# EAGLE schematic MotorEncoder (EAGLE 9.0.0)
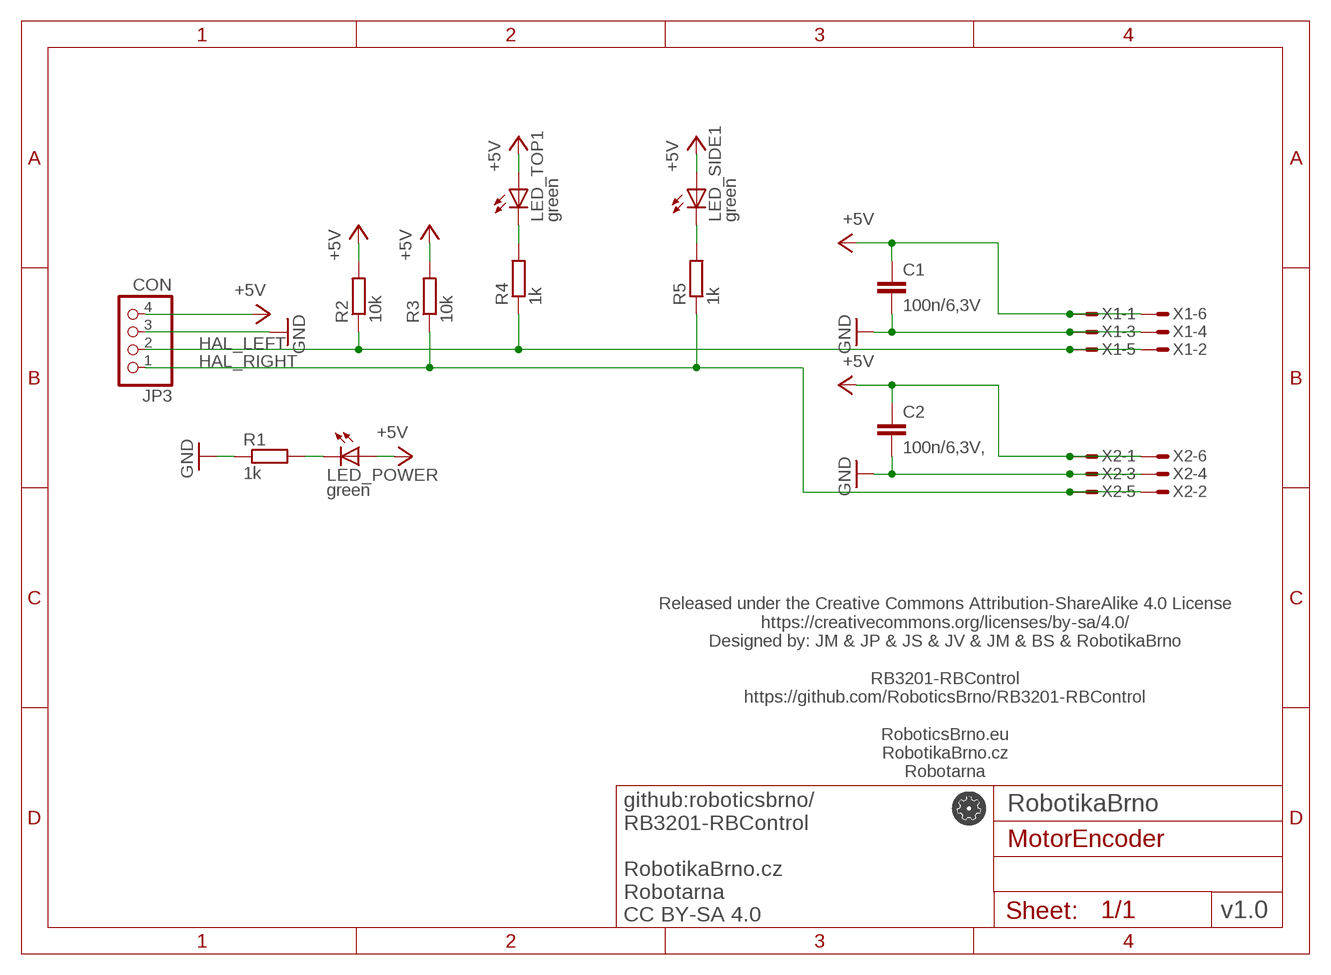
[diagram p0: schematic, sheet 1]

## Parts
C1  100n/6,3V  C-EUC0603  [C0603]
C2  100n/6,3V,  C-EUC0603  [C0603]
JP3  CON  PINHD-1X4/90  [1X04/90]
LED_POWER  green  LEDCHIPLED_0603  [CHIPLED_0603]
LED_SIDE1  green  LEDCHIPLED_0603  [CHIPLED_0603]
LED_TOP1  green  LEDCHIPLED_0603  [CHIPLED_0603]
R1  1k  R-EU_R0603  [R0603]
R2  10k  R-EU_R0603  [R0603]
R3  10k  R-EU_R0603  [R0603]
R4  1k  R-EU_R0603  [R0603]
R5  1k  R-EU_R0603  [R0603]
X1  PHB_1MM27_2X03_SNT_S  [PHB_1MM27_2X03_SNT]
X2  PHB_1MM27_2X03_SNT_S  [PHB_1MM27_2X03_SNT]

## Nets
+5V: C1.1 C2.1 JP3.4 LED_POWER.A LED_SIDE1.A LED_TOP1.A R2.2 R3.2 X1.1 X1.6 X2.1 X2.6
GND: C1.2 C2.2 JP3.3 R1.1 X1.3 X1.4 X2.3 X2.4
HAL_LEFT: JP3.2 R2.1 R4.1 X1.2 X1.5
HAL_RIGHT: JP3.1 R3.1 R5.1 X2.2 X2.5
LED_POWER: LED_POWER.C R1.2
LED_SIDE1: LED_SIDE1.C R5.2
LED_TOP1: LED_TOP1.C R4.2

## Notes on the sheet
- Released under the Creative Commons Attribution-ShareAlike 4.0 License
  https://creativecommons.org/licenses/by-sa/4.0/
  Designed by: JM & JP & JS & JV & JM & BS & RobotikaBrno
  
  RB3201-RBControl
  https://github.com/RoboticsBrno/RB3201-RBControl
  
  RoboticsBrno.eu
  RobotikaBrno.cz
  Robotarna
- RobotikaBrno
- v1.0
- github:roboticsbrno/
  RB3201-RBControl
  
  RobotikaBrno.cz
  Robotarna
  CC BY-SA 4.0

## Library data of the parts
C1 C2 = rcl:C-EU: CAPACITOR, European symbol; SPICEPREFIX: C
JP3 = pinhead:PINHD-1X4: PIN HEADER
LED_POWER LED_SIDE1 LED_TOP1 = led:LED: LED OSRAM: - CHIPLED LG R971, LG N971, LY N971, LG Q971, LY Q971, LO R971, LY R971 LH N974, LH R974 LS Q976, LO Q976, LY Q976 LO Q996 - Hyper CHIPLED LW Q18S LB Q993, LB Q99A, LB R99A - SideLED LS A670, LO A670, LY A670, LG A670, LP A670 LB A673, LV A673, LT A673, LW A673 LH A674 LY A675 LS A676, LA A676, LO A676, LY A676, LW A676 LS A679, LY A679, LG A679 - Hyper Micro SIDELED® LS Y876, LA Y876, LO Y876, LY Y876 LT Y87S - SmartLED LW L88C, LW L88S LB L89C, LB L89S, LG L890 LS L89K, LO L89K, LY L89K LS L896, LA L896, LO L896, LY L896 - TOPLED LS T670, LO T670, LY T670, LG T670, LP T670 LSG T670, LSP T670, LSY T670, LOP T670, LYG T670 LG T671, LOG T671, LSG T671 LB T673, LV T673, LT T673, LW T673 LH T674 LS T676, LA T676, LO T676, LY T676, LB T676, LH T676, LSB T676, LW T676 LB T67C, LV T67C, LT T67C, LS T67K, LO T67K, LY T67K, LW E67C LS E67B, LA E67B, LO E67B, LY E67B, LB E67C, LV E67C, LT E67C LW T67C LS T679, LY T679, LG T679 LS T770, LO T770, LY T770, LG T770, LP T770 LB T773, LV T773, LT T773, LW T773 LH T774 LS E675, LA E675, LY E675, LS T675 LS T776, LA T776, LO T776, LY T776, LB T776 LHGB T686 LT T68C, LB T68C - Hyper Mini TOPLED® LB M676 - Mini TOPLED Santana® LG M470 LS M47K, LO M47K, LY M47K Source: http://www.osram.convergy.de LUXEON: - LUMILED® LXK2-PW12-R00, LXK2-PW12-S00, LXK2-PW14-U00, LXK2-PW14-V00 LXK2-PM12-R00, LXK2-PM12-S00, LXK2-PM14-U00 LXK2-PE12-Q00, LXK2-PE12-R00, LXK2-PE12-S00, LXK2-PE14-T00, LXK2-PE14-U00 LXK2-PB12-K00, LXK2-PB12-L00, LXK2-PB12-M00, LXK2-PB14-N00, LXK2-PB14-P00, LXK2-PB14-Q00 LXK2-PR12-L00, LXK2-PR12-M00, LXK2-PR14-Q00, LXK2-PR14-R00 LXK2-PD12-Q00, LXK2-PD12-R00, LXK2-PD12-S00 LXK2-PH12-R00, LXK2-PH12-S00 LXK2-PL12-P00, LXK2-PL12-Q00, LXK2-PL12-R00 Source: www.luxeon.com KINGBRIGHT: KA-3528ASYC Source: www.kingbright.com; DIGIKEY: 160-1446-1-ND; FARNELL: 2293494; MOUSER: 859-LTST-C191KGKT; RS: 872-1799
R1-R5 = rcl:R-EU_: RESISTOR, European symbol; SPICEPREFIX: R
X1 X2 = _hhn_con_pinhead_box_1mm27:PHB_1MM27_2X03_?_S: Pin Header Box-Type, 1.27mm/0.5"/50mil Pitch, 2x03 Circuits, single gates in schematic Note: see library description for an important note about THT-version